# EAGLE design untitled (EAGLE 7.0.0)
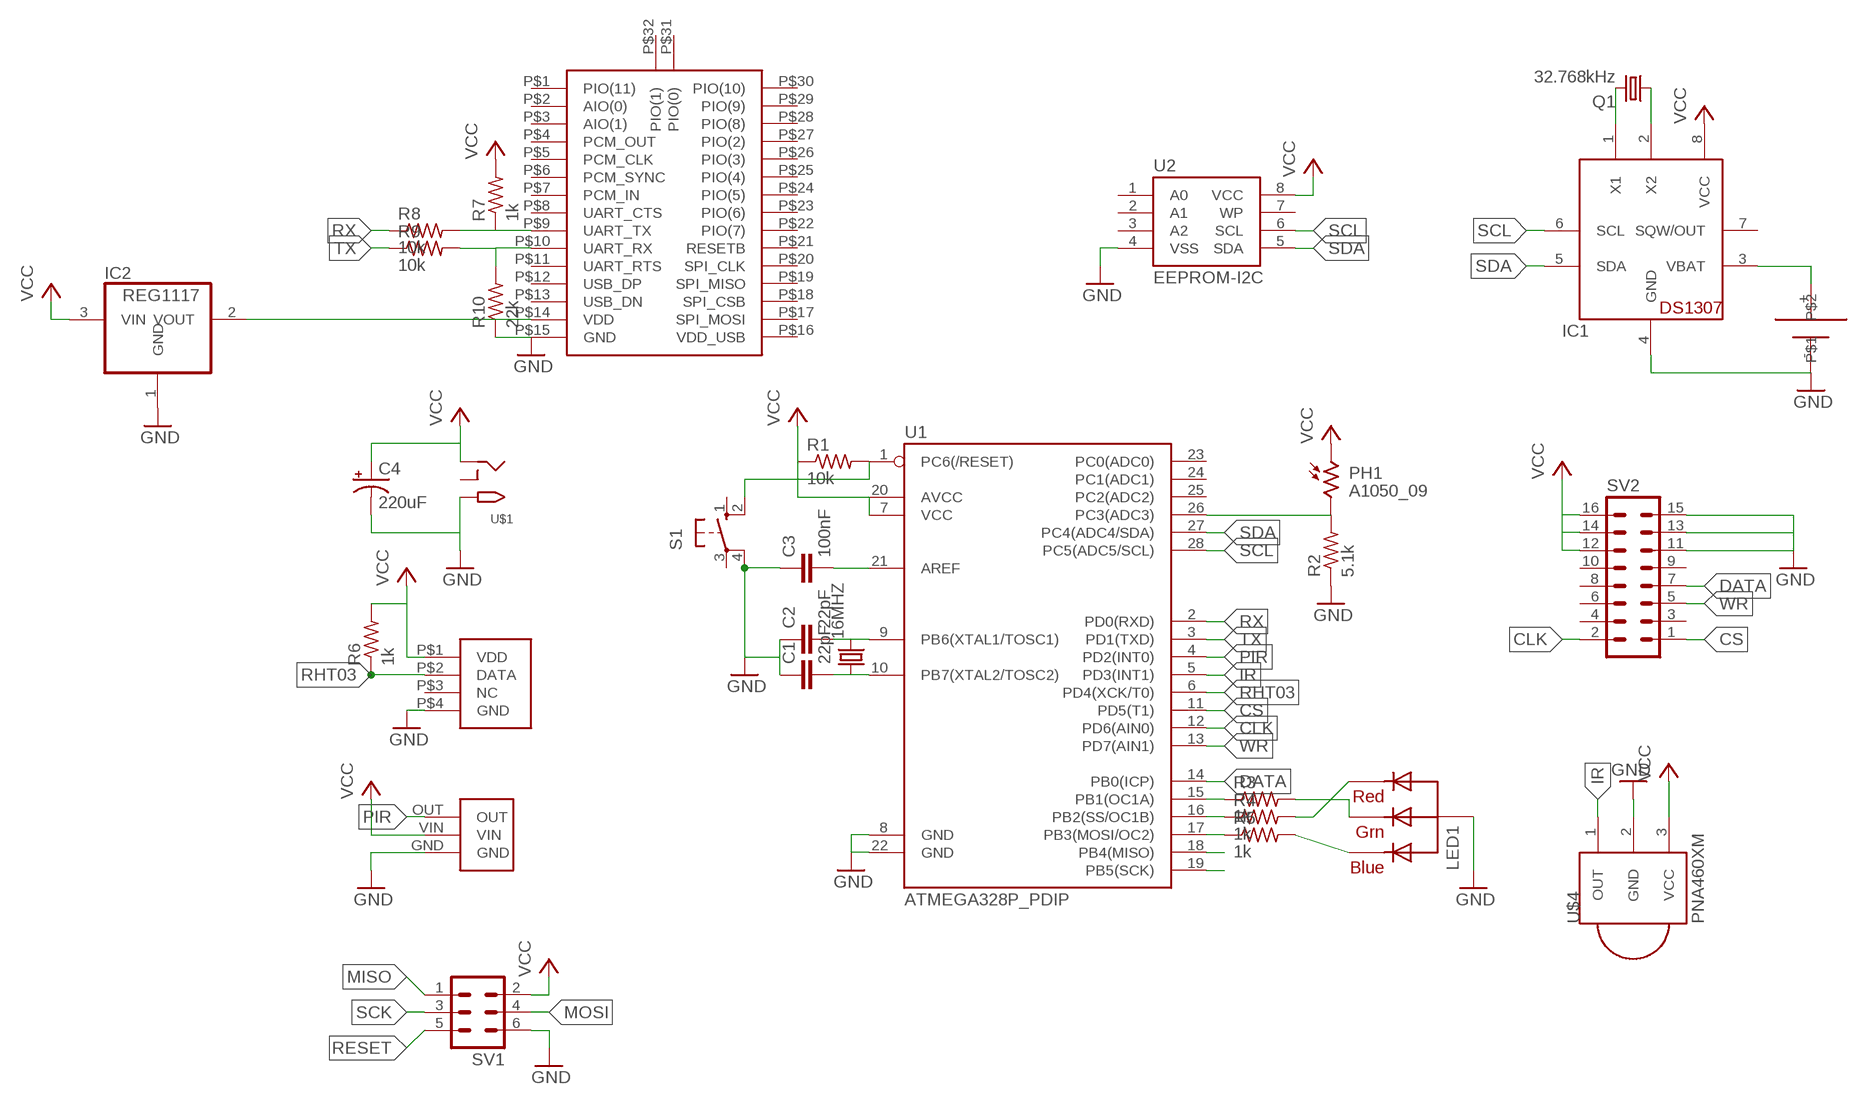
[diagram p0: schematic, sheet 1]

## Parts
16MHZ  CRYSTALHC49U-H  [HC49U-H]
C1  22pF  C-EU025-024X044  [C025-024X044]
C2  22pF  C-EU025-024X044  [C025-024X044]
C3  100nF  C-EU025-024X044  [C025-024X044]
C4  220uF  CPOL-USE3.5-8  [E3,5-8]
IC1  DS1307  [DIL08]
IC2  REG1117  [SOT223]
LED1  RGBLED_CA-5MM  [LED5MMRGB]
PH1  A1050_09  [T0-46-A10XX]
Q1  32.768kHz  CRYSTALTC38H  [TC38H]
R1  10k  R-US_0207/10  [0207/10]
R2  5.1k  R-US_0207/10  [0207/10]
R3  1k  R-US_0207/10  [0207/10]
R4  1k  R-US_0207/10  [0207/10]
R5  1k  R-US_0207/10  [0207/10]
R6  1k  R-US_0207/10  [0207/10]
R7  1k  R-US_0207/10  [0207/10]
R8  10k  R-US_0207/10  [0207/10]
R9  10k  R-US_0207/10  [0207/10]
R10  22k  R-US_0207/10  [0207/10]
S1  10-XX  [B3F-10XX]
SV1  ML6  [ML6]
SV2  ML16  [ML16]
U1  ATMEGA328P_PDIP  [DIL28-3]
U2  EEPROM-I2C  [DIL08]
U$1  2.1MMJACK  [2.1MMJACK_BREADBOARD]
U$2  RHT03THROUGH_HOLE  [RHT03]
U$3  PIR_PM-6  [PIR_THROUGHHOLE]
U$4  PNA460XM  [PNA460XM]
U$5  CR2032  [CR2032-THM]
U$6  BTM-182  [BTM-182]

## Nets
CLK: SV2.2 U1.12(PD6(AIN0))
CS: SV2.1 U1.11(PD5(T1))
DATA: SV2.7 U1.14(PB0(ICP))
GND: C1.1 C2.1 C3.1 C4.- IC1.4(GND) IC2.1(GND) LED1.2(VCC) R2.1 R10.1 S1.4(P1) SV1.6 SV2.11 SV2.13 SV2.15 U1.8(GND) U1.22(GND) U2.4(VSS) U$1.GND(TIP) U$2.P$4(GND) U$3.GND U$4.2(GND) U$5.- U$6.P$15(GND)
IR: U1.5(PD3(INT1)) U$4.1(OUT)
MISO: SV1.1 U1.18(PB4(MISO))
MOSI: R5.1 SV1.4 U1.17(PB3(MOSI/OC2))
N$1: 16MHZ.1 C1.2 U1.10(PB7(XTAL2/TOSC2))
N$2: 16MHZ.2 C2.2 U1.9(PB6(XTAL1/TOSC1))
N$3: C3.2 U1.21(AREF)
N$4: R4.1 U1.16(PB2(SS/OC1B))
N$5: R3.1 U1.15(PB1(OC1A))
N$6: PH1.2 R2.2 U1.26(PC3(ADC3))
N$7: IC1.3(VBAT) U$5.+
N$8: IC2.2(VOUT) U$6.P$14(VDD)
N$9: LED1.1(RED) R4.2
N$10: LED1.3(GREEN) R3.2
N$11: LED1.4(BLUE) R5.2
N$12: IC1.1(X1) Q1.2
N$13: IC1.2(X2) Q1.1
N$14: R7.1 R8.2 U$6.P$9(UART_TX)
N$15: R9.2 R10.2 U$6.P$10(UART_RX)
PIR: U1.4(PD2(INT0)) U$3.OUT
RESET: R1.2 S1.2(S1) SV1.5 U1.1(PC6(/RESET))
RHT03: R6.1 U1.6(PD4(XCK/T0)) U$2.P$2(DATA)
RX: R8.1 U1.2(PD0(RXD))
SCK: SV1.3 U1.19(PB5(SCK))
SCL: IC1.6(SCL) U1.28(PC5(ADC5/SCL)) U2.6(SCL)
SDA: IC1.5(SDA) U1.27(PC4(ADC4/SDA)) U2.5(SDA)
TX: R9.1 U1.3(PD1(TXD))
VCC: C4.+ IC1.8(VCC) IC2.3(VIN) PH1.1 R1.1 R6.2 R7.2 SV1.2 SV2.12 SV2.14 SV2.16 U1.7(VCC) U1.20(AVCC) U2.8(VCC) U$1.PWR(RING) U$2.P$1(VDD) U$3.VIN U$4.3(VCC)
WR: SV2.5 U1.13(PD7(AIN1))
Unconnected: IC1.7(SQW/OUT) S1.1(S) S1.3(P) SV2.3 SV2.4 SV2.6 SV2.8 SV2.9 SV2.10 U1.23(PC0(ADC0)) U1.24(PC1(ADC1)) U1.25(PC2(ADC2)) U2.1(A0) U2.2(A1) U2.3(A2) U2.7(WP) U$1.GNDBREAK(RING_SW) U$2.P$3(NC) U$6.P$1(PIO(11)) U$6.P$2(AIO(0)) U$6.P$3(AIO(1)) U$6.P$4(PCM_OUT) U$6.P$5(PCM_CLK) U$6.P$6(PCM_SYNC) U$6.P$7(PCM_IN) U$6.P$8(UART_CTS) U$6.P$11(UART_RTS) U$6.P$12(USB_DP) U$6.P$13(USB_DN) U$6.P$16(VDD_USB) U$6.P$17(SPI_MOSI) U$6.P$18(SPI_CSB) U$6.P$19(SPI_MISO) U$6.P$20(SPI_CLK) U$6.P$21(RESETB) U$6.P$22(PIO(7)) U$6.P$23(PIO(6)) U$6.P$24(PIO(5)) U$6.P$25(PIO(4)) U$6.P$26(PIO(3)) U$6.P$27(PIO(2)) U$6.P$28(PIO(8)) U$6.P$29(PIO(9)) U$6.P$30(PIO(10)) U$6.P$31(PIO(0)) U$6.P$32(PIO(1))

## Library data of the parts
16MHZ = crystal:CRYSTAL: CRYSTAL; OC_FARNELL: 1666973; OC_NEWARK: unknown
C1-C3 = rcl:C-EU: CAPACITOR, European symbol
C4 = adafruit:CPOL-US: POLARIZED CAPACITOR, American symbol
IC1 = adafruit:DS1307: DS1307 Real time clock (RTC) with battery backup ability. Talk to it via i2c
IC2 = burr-brown:REG1117: 800mA and 1A Low Dropout (LDO) Positive Regulator 1.8V, 2.5V, 2.85V, 3.3V, 5V, and Adj; MPN: REG1117; OC_FARNELL: 1097566; OC_NEWARK: 14P6981
LED1 = adafruit:RGBLED_CA: RGB LED, common-anode 5MM Staggered pins 5mm Piranha package http://www.ladyada.net/library/pcb/eaglelibrary.html
PH1 = photo-elements:A10: Sensor Robust Light Sensing Applications Outdoor Light Sensing Application Source: http://optoelectronics.perkinelmer.com/content/Datasheets/DTS_PhotocellsA1050.pdf
Q1 = crystal:CRYSTAL: CRYSTAL; OC_FARNELL: unknown; OC_NEWARK: unknown
R1-R10 = adafruit:R-US_: RESISTOR, American symbol
S1 = switch-omron:10-XX: OMRON SWITCH; MPN: B3F-1000; OC_FARNELL: 176432; OC_NEWARK: 36M3542
SV1 = con-ml:ML6: HARTING; OC_FARNELL: unknown; OC_NEWARK: unknown
SV2 = con-ml:ML16: HARTING; OC_FARNELL: unknown; OC_NEWARK: unknown
U1 = SparkFun-DigitalIC:ATMEGA328P_PDIP: uC used in the Arduino 32kb flash, 1k EEPROM, 2k SRAM This is the through-hole version of this chip.
U2 = SparkFun-DigitalIC:EEPROM-I2C: I2C EEPROM chips, 24LC256 (and others)
U$1 = adafruit:2.1MMJACK: 2.1mm x 5.5mm THM DC jack with internal switch. Digikey part #PJ-102A, 4UCON part #05537 2.1mm x 5.5mm SMT DC jack with internal switch. Digikey part #PJ-002A-SMT, 4UCON part #03267 By microbuilder.eu & adafruit.com
U$2 = RHT03:RHT03
U$3 = PIR:PIR_PM-6: Pyroelectric Infrared Sensor Module Pir Module Motion Sensor Detector Module Pm-6
U$4 = adafruit:PNA460XM: IR 38KHz receiver PNA4602 and related receivers http://www.ladyada.net/library/pcb/eaglelibrary.html
U$5 = CR2032:CR2032
U$6 = BTM-182:BTM-182: Class2 BC04-ext Bluetooth Module

## Board
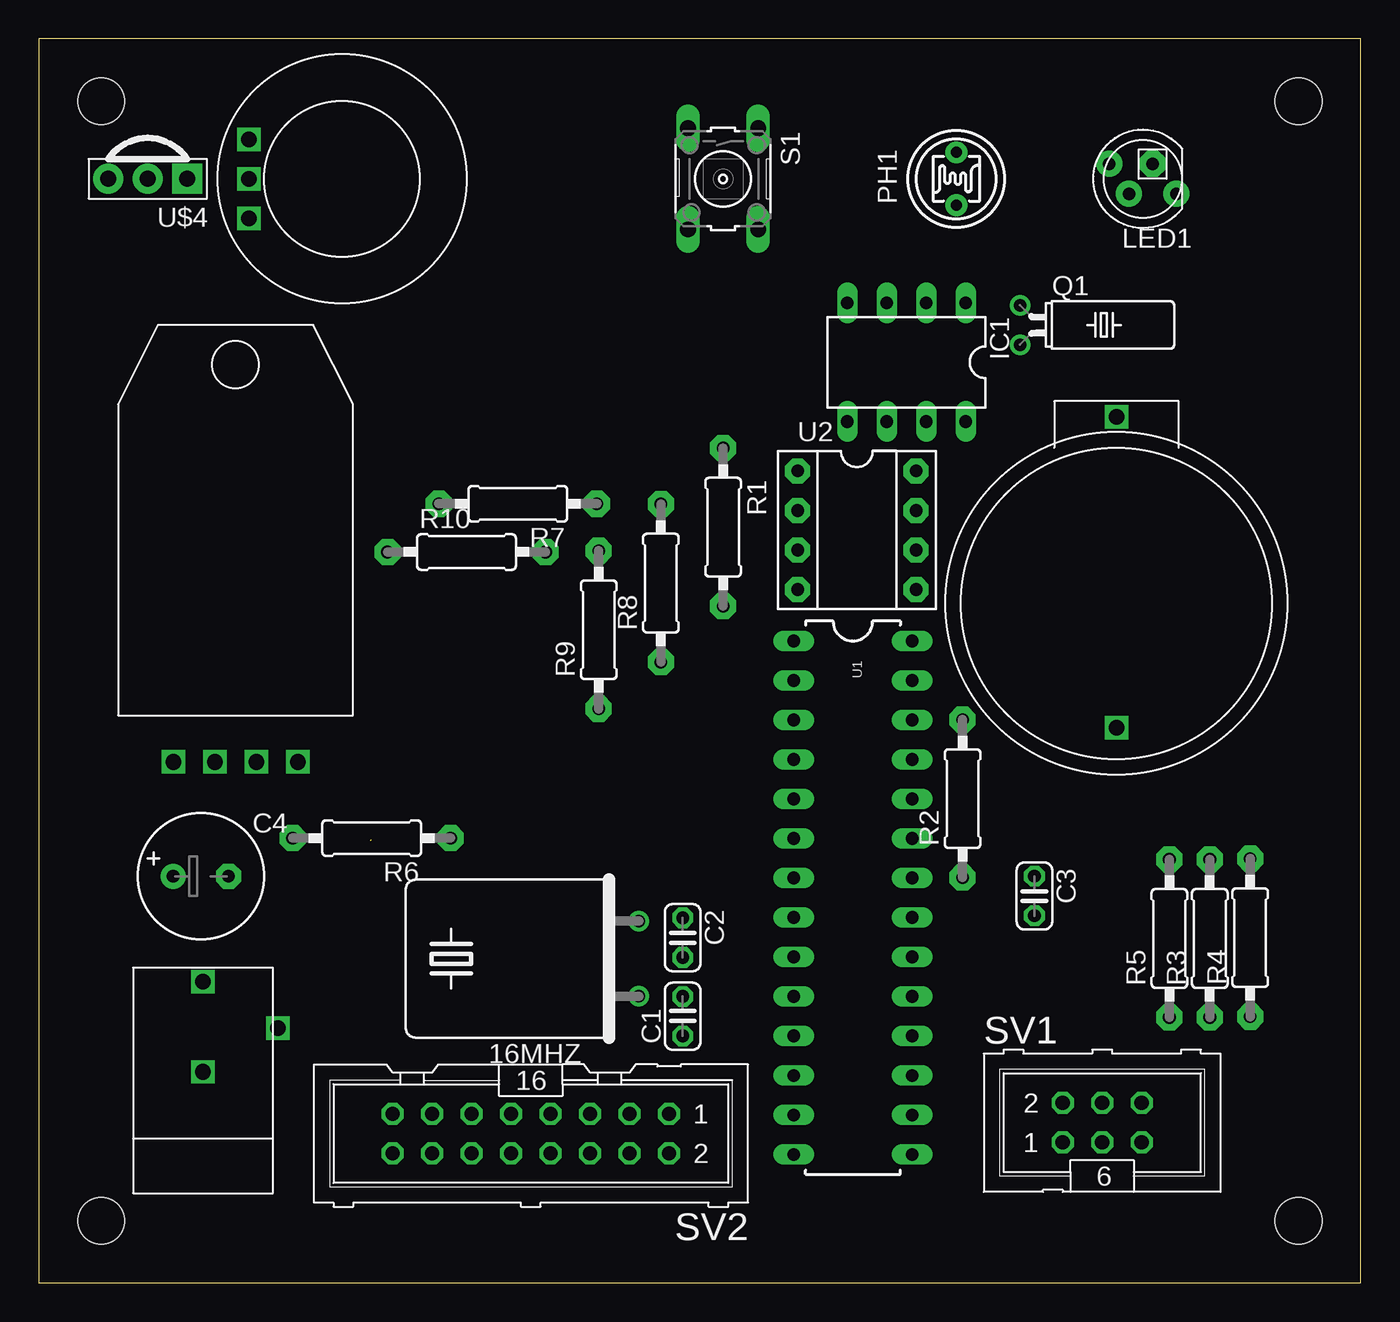
[diagram p1: board, top side]
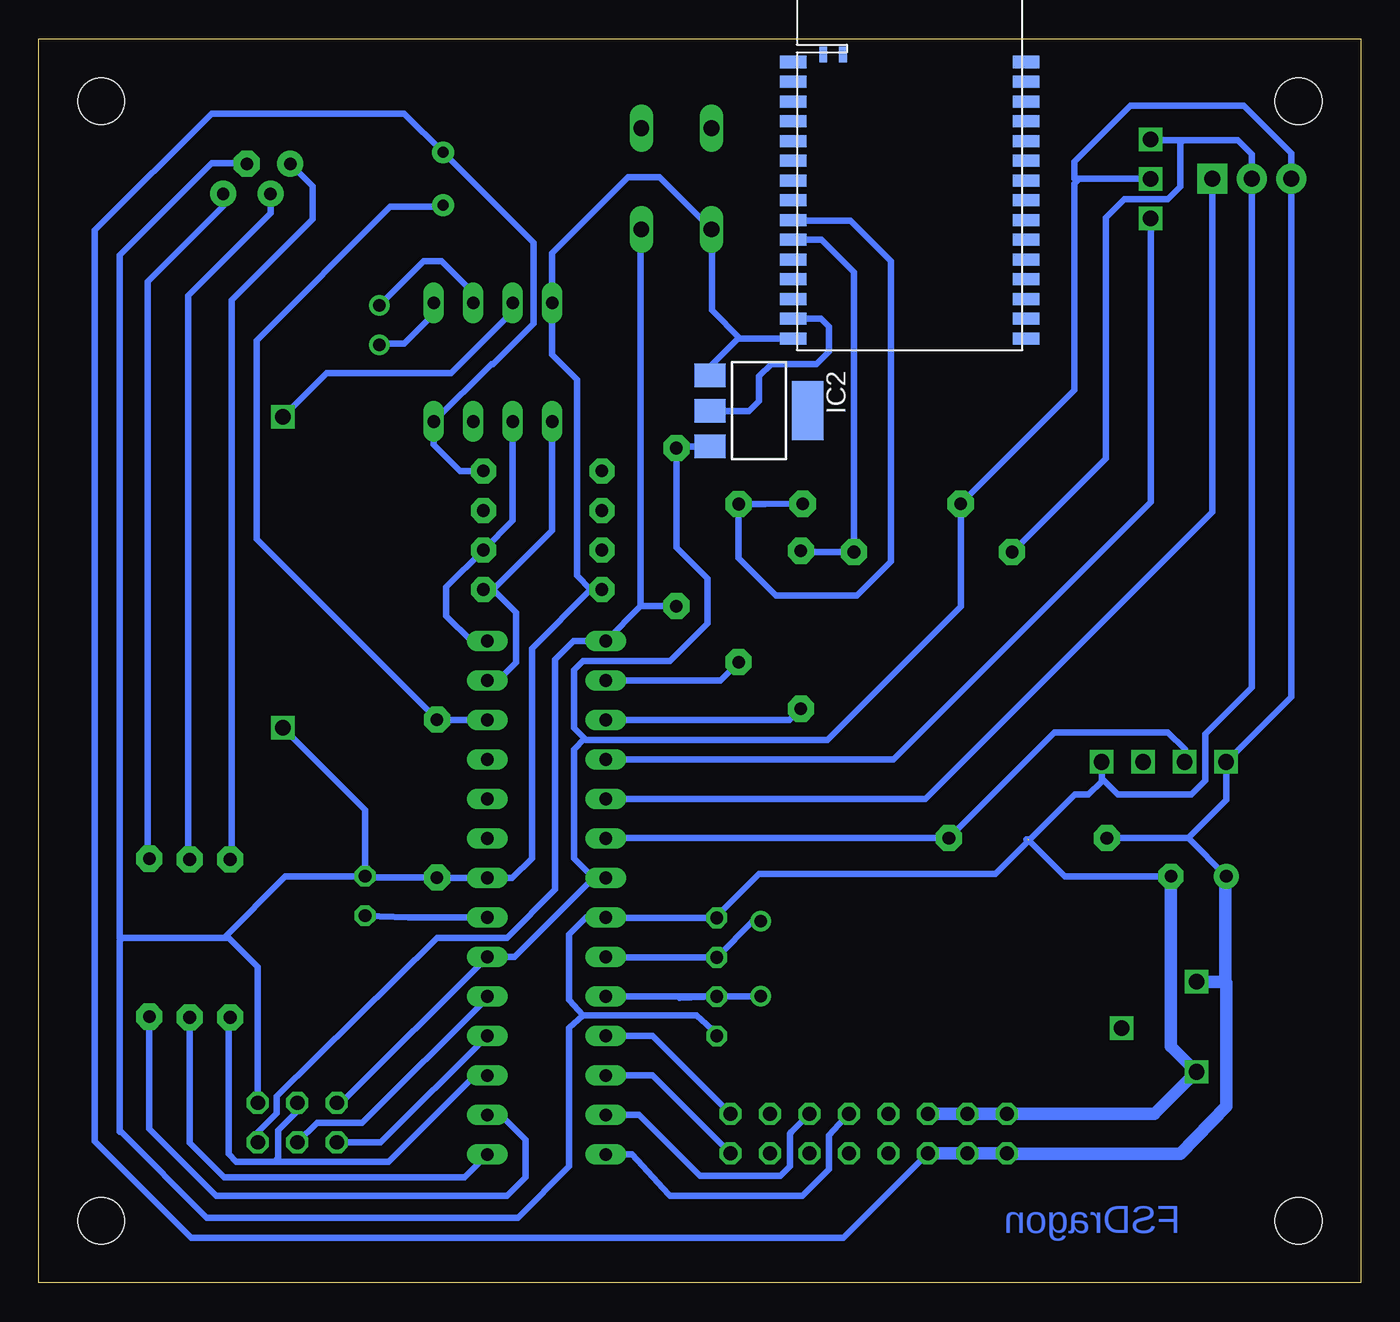
[diagram p2: board, bottom side, seen from below]

Size 85 x 80 mm. Coordinates in mm from the lower left corner, seen from the top.
Outline: 0,0 85,0 85,80 0,80 0,0
Copper layers 1: Top 0.035mm
Design rules "default *": minimum track width 10mil, minimum drill 24mil, track to track 8mil, track to pad 8mil, pad to pad 8mil, via to via 8mil, smd to smd 8mil, copper to edge 40mil, drill to drill 8mil, minimum pad ring 10mil, minimum via ring 8mil, stop-mask expansion 4mil, vias tented up to drill 0mil, thermal gap 10mil
Holes 3 mm at 4,4 81,76 81,4 4,76

### Footprints (pad centres in the part's own frame; a part is rotated, then mirrored left to right if it is on the bottom)
HC49U-H = drill 0.813: 1 -2.413,-5.08; 2 2.413,-5.08
C025-024X044 = drill 0.813 octagon: 1 -1.27,0; 2 1.27,0
E3,5-8 = drill 0.813 pad 1.6: + -1.778,0 | drill 0.813 pad 1.6 octagon: - 1.778,0
DIL08 = drill 0.813 long: 1 -3.81,-3.81; 2 -1.27,-3.81; 3 1.27,-3.81; 4 3.81,-3.81; 5 3.81,3.81; 6 1.27,3.81; 7 -1.27,3.81; 8 -3.81,3.81
SOT223 = smd 1.499 x 2.007: 1 -2.261,-3.15; 2 0.025,-3.15; 3 2.311,-3.15 | smd 3.81 x 2.007: 4 0,3.15
LED5MMRGB = drill 0.8 pad 1.676: 1 -2.159,0.968; 3 0.889,0.968; 4 2.159,-0.968 | drill 0.8 pad 1.676 octagon: 2 -0.635,-0.968
T0-46-A10XX = drill 0.7 pad 1.4: 1 -1.7,0; 2 1.7,0
TC38H = drill 0.813: 1 -1.27,0; 2 1.27,0
0207/10 = drill 0.813 pad 1.676 octagon: 1 -5.08,0; 2 5.08,0
B3F-10XX = drill 1.016 long: 1 -3.251,2.261; 2 3.251,2.261; 3 -3.251,-2.261; 4 3.251,-2.261
ML6 = drill 0.914 octagon: 1 -2.54,-1.27; 2 -2.54,1.27; 3 0,-1.27; 4 0,1.27; 5 2.54,-1.27; 6 2.54,1.27
ML16 = drill 0.914 octagon: 1 -8.89,-1.27; 2 -8.89,1.27; 3 -6.35,-1.27; 4 -6.35,1.27; 5 -3.81,-1.27; 6 -3.81,1.27; 7 -1.27,-1.27; 8 -1.27,1.27; 9 1.27,-1.27; 10 1.27,1.27; 11 3.81,-1.27; 12 3.81,1.27; 13 6.35,-1.27; 14 6.35,1.27; 15 8.89,-1.27; 16 8.89,1.27
DIL28-3 = drill 0.813 long: 1 -16.51,-3.81; 2 -13.97,-3.81; 3 -11.43,-3.81; 4 -8.89,-3.81; 5 -6.35,-3.81; 6 -3.81,-3.81; 7 -1.27,-3.81; 8 1.27,-3.81; 9 3.81,-3.81; 10 6.35,-3.81; 11 8.89,-3.81; 12 11.43,-3.81; 13 13.97,-3.81; 14 16.51,-3.81; 15 16.51,3.81; 16 13.97,3.81; 17 11.43,3.81; 18 8.89,3.81; 19 6.35,3.81; 20 3.81,3.81; 21 1.27,3.81; 22 -1.27,3.81; 23 -3.81,3.81; 24 -6.35,3.81; 25 -8.89,3.81; 26 -11.43,3.81; 27 -13.97,3.81; 28 -16.51,3.81
DIL08' = drill 0.813 pad 1.6 octagon: 1 -3.81,-3.81; 2 -1.27,-3.81; 3 1.27,-3.81; 4 3.81,-3.81; 5 3.81,3.81; 6 1.27,3.81; 7 -1.27,3.81; 8 -3.81,3.81
2.1MMJACK_BREADBOARD = drill 1 square: GND 7.8,4.5; GNDBREAK 10.6,-0.3; PWR 13.6,4.5
RHT03 = drill 1 square: P$1 3.55,-3; P$2 6.22,-3; P$3 8.88,-3; P$4 11.55,-3
PIR_THROUGHHOLE = drill 1 square: GND 6,-2.54; OUT 6,2.54; VIN 6,0
PNA460XM = drill 1.016 pad 1.93 square: 1 -2.54,0 | drill 1.016 pad 1.93: 2 0,0; 3 2.54,0
CR2032-THM = drill 1 square: + 12,0; - -8,0
BTM-182 = smd 0.78 x 1.7: P$1 -6.01,-7.5; P$2 -4.74,-7.5; P$3 -3.47,-7.5; P$4 -2.2,-7.5; P$5 -0.93,-7.5; P$6 0.34,-7.5; P$7 1.61,-7.5; P$8 2.88,-7.5; P$9 4.15,-7.5; P$10 5.42,-7.5; P$11 6.69,-7.5; P$12 7.96,-7.5; P$13 9.23,-7.5; P$14 10.5,-7.5; P$15 11.77,-7.5; P$16 11.77,7.5; P$17 10.5,7.5; P$18 9.23,7.5; P$19 7.96,7.5; P$20 6.69,7.5; P$21 5.42,7.5; P$22 4.15,7.5; P$23 2.88,7.5; P$24 1.61,7.5; P$25 0.34,7.5; P$26 -0.93,7.5; P$27 -2.2,7.5; P$28 -3.47,7.5; P$29 -4.74,7.5; P$30 -6.01,7.5 | smd 1.016 x 0.508: P$31 -6.5,-4.29; P$32 -6.5,-5.56

### Placement (x,y rotation side)
16MHZ  33.5,20.85 90 top
C1  41.4,17.15 90 top
C2  41.4,22.2 270 top
C3  64.02,24.88 270 top
C4  10.42,26.15 0 top
IC1  55.8,59.2 180 top
IC2  38.7,56.1 270 bottom
LED1  70.99,71 180 top
PH1  59,71 270 top
Q1  63.1,61.6 270 top
R1  44,48.6 270 top
R2  59.4,31.14 90 top
R3  75.3,22.15 90 top
R4  77.9,22.2 90 top
R5  72.7,22.15 90 top
R6  21.4,28.6 180 top
R7  30.8,50.1 180 top
R8  40,45 90 top
R9  36,42 90 top
R10  27.5,47 0 top
S1  44,71 270 top
SV1  68.38,10.3 0 top
SV2  31.64,9.6 180 top
U1  52.35,24.77 270 top
U2  EEPROM-I2C  [DIL08']  52.6,48.4 270 top
U$1  15.06,5.77 90 top
U$2  5.1,36.5 0 top
U$3  19.5,71 180 top
U$4  7,71 180 top
U$5  69.3,43.7 90 top
U$6  29,72.5 270 bottom

### Tracks (layer width: path | path; a pad name or v marks a point on that pad's centre or on a via)
CLK
  Bottom 0.406: U1.12 45.54,13.34 SV2.2
CS
  Bottom 0.406: U1.11 45.54,15.88 SV2.1
DATA
  Bottom 0.406: SV2.7 32.93,10.87 34.2,9.5 34.2,7.3 35.9,5.6 44.4,5.6 44.5,5.7 46.86,8.26 U1.14
GND  (1 unrouted)
  Bottom 0.406: C2.1 41.53,23.47 | 41.53,23.47 48.51,23.47 U1.8 49.8,23.5 50.9,22.4 50.9,18.2 50,17.2 | 79.6,22.2 79.8,22.2 79.8,66.1 73.9,72 71.66,72 LED1.2 | 79.6,22.2 73.1,22.2 | 73.1,22.2 72.8,22.2 70.92,20.32 SV1.6 | C1.1 41.4,16 42.7,17.2 50,17.2 | U2.4 49.51,44.59 | C3.1 63.93,26.06 R2.1 59.58,26.04 U1.22 54.56,26.04 53.3,27.3 53.3,40.8 49.51,44.59 | IC1.4 | 79.6,22.2 79.8,22 79.8,9.7 79.7,9.7 74.2,4.2 54.2,4.2 50.9,7.5 50.9,16.4 50,17.2 | C3.1 69.15,26.15 73.1,22.2 | 21.48,28.52 21.4,28.52 | C3.1 64.02,30.42 U$5.- | U$2.P$4 16.65,32.65 | U$2.P$4 16.65,32.25 17.5,31.4 18.39,31.4 21.32,28.47 | C4.- 19,26.15 21.32,28.47 | 11.4,73.5 7.9,73.5 7,72.6 U$4.2 7,38.3 10,35.3 10,32.3 10.9,31.4 15.6,31.4 16.65,32.45 U$2.P$4 | 21.32,28.47 23.49,26.3 38.7,26.3 41.53,23.47 | IC1.4 51.99,59.69 50.4,58.1 50.4,45.48 49.51,44.59 | 11.4,73.5 11.6,73.3 11.6,70.5 12.4,69.7 15.2,69.7 16.4,68.5 16.4,53 22.3,47.1 R10.1 | 11.4,73.5 13.46,73.5 U$3.GND | IC1.4 51.99,66.21 47.1,71.1 45.09,71.1 S1.4 41.72,67.73 41.72,62.55 39.9,60.73 | U$6.P$15 39.9,60.73 | 39.9,60.73 40.03,60.73 41.85,58.91 IC2.1
  Bottom 0.813: SV2.11 SV2.13 SV2.15 13.26,10.87 U$1.GND 12.2,15.21 C4.-
IR
  Bottom 0.406: U1.5 27.98,31.12 9.54,49.56 U$4.1
MISO
  Bottom 0.406: U1.18 63.01,9.03 SV1.1
MOSI
  Bottom 0.406: SV1.4 68.38,11.02 69.6,9.8 69.6,8 69.8,7.8 | R5.1 72.8,16.97 72.8,8.3 72.3,7.8 69.8,7.8 | U1.17 56.96,13.34 62.5,7.8 69.8,7.8
N$1
  Bottom 0.406: U1.10 C1.2 | C1.2 43.82,18.34 | 16MHZ.1 39.35,18.42 C1.2
N$2
  Bottom 0.406: C2.2 41.56,21.03 | C2.2 48.51,20.93 U1.9 | 16MHZ.2 39.07,23.26 C2.2
N$3
  Bottom 0.406: U1.21 61.23,23.5 C3.2
N$4
  Bottom 0.406: U1.16 55.3,10.8 53.7,9.2 53.7,6.8 54.9,5.6 73.6,5.6 77.9,9.9 R4.1
N$5
  Bottom 0.406: R3.1 75.3,9 73.1,6.8 57.62,6.8 U1.15
N$6
  Bottom 0.406: U1.26 59.58,36.2 R2.2 71,47.82 71,60.6 62.4,69.2 59.1,69.2 PH1.2
N$7
  Bottom 0.406: IC1.3 54.53,62.47 58.5,58.5 66.5,58.5 U$5.+
N$8
  Bottom 0.406: U$6.P$14 34.7,62 34.2,61.5 34.2,59.9 35,59.1 37.9,59.1 38.7,58.3 38.7,56.7 39.33,56.08 IC2.2
N$9
  Bottom 0.406: R4.2 78,27.38 78,64.4 73.15,69.25 LED1.1
N$10
  Bottom 0.406: R3.2 75.4,27.33 75.4,63.5 70.1,68.8 LED1.3
N$11
  Bottom 0.406: R5.2 72.6,27.33 72.6,63.2 67.4,68.4 67.4,70.54 LED1.4
N$12
  Bottom 0.406: IC1.1 59.61,62.29 61.5,60.4 63.03,60.4 Q1.2
N$13
  Bottom 0.406: IC1.2 57.07,63.67 59.1,65.7 60.27,65.7 Q1.1
N$14
  Bottom 0.406: R7.1 38.3,50.08 R8.2 40,46.6 37.6,44.2 32.4,44.2 30.2,46.4 30.2,65.7 32.8,68.3 36.45,68.3 U$6.P$9
N$15
  Bottom 0.406: R9.2 35.92,47 R10.2 32.6,48.68 32.6,65 34.68,67.08 U$6.P$10 35.88,67.08
PIR
  Bottom 0.406: U1.4 30.04,33.66 13.5,50.2 U$3.OUT
RESET
  Bottom 0.406: SV1.5 70.92,9.68 69.7,10.9 69.7,12 59.5,22.1 59.4,22.2 54.9,22.2 51.8,25.3 51.8,40.1 50.62,41.28 U1.1 46.3,43.52 | R1.2 46.3,43.52 | 46.3,43.52 46.3,67.71 S1.2
RHT03
  Bottom 0.406: U1.6 48.54,28.6 R6.1 19.68,35.4 12.4,35.4 11.32,34.32 U$2.P$2
RX
  Bottom 0.406: U1.2 41.18,38.74 R8.1
SCK
  Bottom 0.406: U1.19 56.16,18.34 64.2,10.3 67.11,10.3 SV1.3
SCL
  Bottom 0.406: IC1.6 54.53,49.01 U2.6 58.8,44.74 58.8,42.9 57.18,41.28 U1.28
SDA
  Bottom 0.406: IC1.5 51.99,48.39 55.79,44.59 | U2.5 55.79,44.59 | 55.79,44.59 54.3,43.1 54.3,39.9 55.46,38.74 U1.27
TX
  Bottom 0.406: U1.3 36.72,36.2 R9.1
VCC
  Bottom 0.406: SV1.2 65.55,11.57 U1.20 54.42,20.96 49.34,26.04 | 8.71,26.15 C4.+ 11.09,28.6 | U2.8 57.9,52.2 59.61,53.91 IC1.8 55.9,59.1 55.8,59.1 53.2,61.7 53.2,66.9 PH1.1 61.5,75.2 73.9,75.2 81.4,67.7 81.4,9.1 75.2,2.9 33.26,2.9 SV2.12 | 11.09,28.6 R6.2 | 11.09,28.6 8.65,31.04 U$2.P$1 4.46,37.69 U$4.3 4.46,72.66 7.5,75.7 14.8,75.7 18.4,72.1 18.4,71 18.1,71 | 49.9,35 50.6,35.7 50.6,39.4 50,40 44.4,40 42,42.4 42,45.3 44,47.3 R1.1 43.89,53.79 IC2.3 | 49.9,35 50.6,34.3 50.6,27.3 49.34,26.04 | U1.7 49.34,26.04 | U$3.VIN 18.1,71 | 49.9,35 49.8,34.9 34.3,34.9 25.72,43.48 R7.2 18.4,57.42 18.4,70.7 18.1,71
  Bottom 0.813: SV2.12 SV2.14 SV2.16 | 22.72,8.3 SV2.16 | U$1.PWR 8.71,19.37 | 8.71,19.37 8.64,19.3 8.64,11.36 11.6,8.3 22.42,8.3 SV2.16 | 8.71,26.15 8.71,19.37
WR
  Bottom 0.406: SV2.5 36.6,9.72 36.7,9.6 36.7,7.5 37.3,6.9 42.5,6.9 46.4,10.8 U1.13

### Text on the board
Bottom: FSDragon